# Altium project stm32dev.PrjPcb
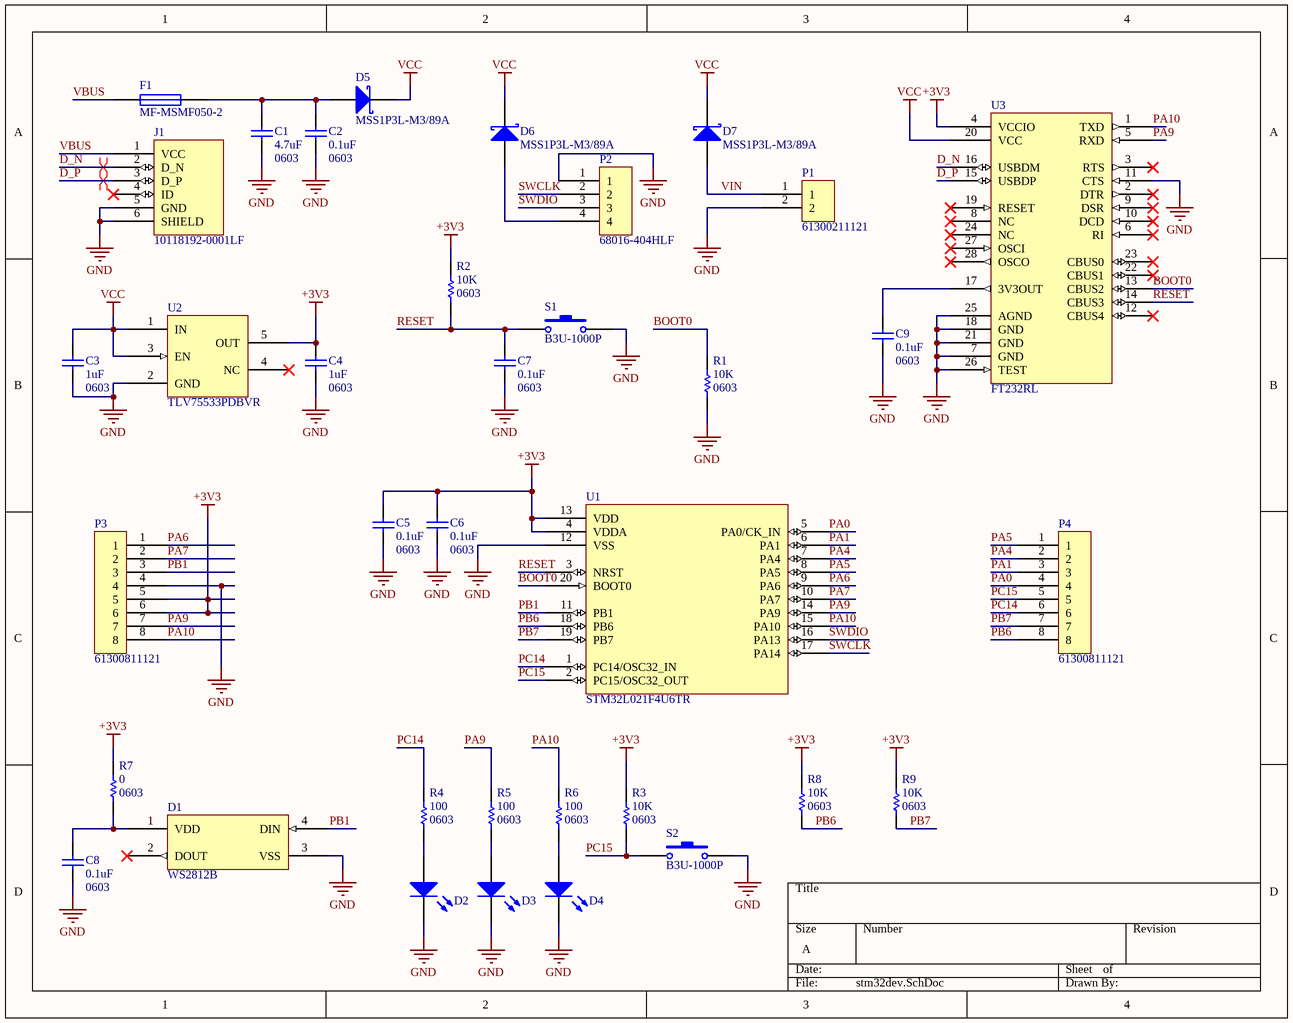
[diagram p0: stm32dev.SchDoc]
1 sheet, 36 parts. Net scope: global (net labels, ports and power ports of the same name join across sheets).
Board file: stm32dev.PcbDoc

## Sheet stm32dev.SchDoc: STM32DEV
size A; Revision: 1; SheetNumber: 1; SheetTotal: 1

### Parts
C1  value 4.7uF  Package: 0603  [CAPC1608X09N]  (hidden comment: Capacitor)
C2  value 0.1uF  Package: 0603  [CAPC1608X09N]  (hidden comment: Capacitor)
C3  value 1uF  Package: 0603  [CAPC1608X09N]  (hidden comment: Capacitor)
C4  value 1uF  Package: 0603  [CAPC1608X09N]  (hidden comment: Capacitor)
C5  value 0.1uF  Package: 0603  [CAPC1608X09N]  (hidden comment: Capacitor)
C6  value 0.1uF  Package: 0603  [CAPC1608X09N]  (hidden comment: Capacitor)
C7  value 0.1uF  Package: 0603  [CAPC1608X09N]  (hidden comment: Capacitor)
C8  value 0.1uF  Package: 0603  [CAPC1608X09N]  (hidden comment: Capacitor)
C9  value 0.1uF  Package: 0603  [CAPC1608X09N]  (hidden comment: Capacitor)
D1  WS2812B  [5050]
D2  LED  [DIOC1608X09N]  (value not drawn)
D3  LED  [DIOC1608X09N]  (value not drawn)
D4  LED  [DIOC1608X09N]  (value not drawn)
D5  MSS1P3L-M3/89A  [DO-219AD]
D6  MSS1P3L-M3/89A  [DO-219AD]
D7  MSS1P3L-M3/89A  [DO-219AD]
F1  MF-MSMF050-2  [1812 (4532 Metric)]
J1  10118192-0001LF  [10118192-0001LF]
P1  61300211121  [2X1 MALE HEADER]
P2  68016-404HLF  [68016-404HLF]
P3  61300811121  [8X1 MALE HEADER]
P4  61300811121  [8X1 MALE HEADER]
R1  value 10K  Package: 0603  [RESC1608X06N]  (hidden comment: Resistor)
R2  value 10K  Package: 0603  [RESC1608X06N]  (hidden comment: Resistor)
R3  value 10K  Package: 0603  [RESC1608X06N]  (hidden comment: Resistor)
R4  value 100  Package: 0603  [RESC1608X06N]  (hidden comment: Resistor)
R5  value 100  Package: 0603  [RESC1608X06N]  (hidden comment: Resistor)
R6  value 100  Package: 0603  [RESC1608X06N]  (hidden comment: Resistor)
R7  value 0  Package: 0603  [RESC1608X06N]  (hidden comment: Resistor)
R8  value 10K  Package: 0603  [RESC1608X06N]  (hidden comment: Resistor)
R9  value 10K  Package: 0603  [RESC1608X06N]  (hidden comment: Resistor)
S1  B3U-1000P  [B3U-1000P]
S2  B3U-1000P  [B3U-1000P]
U1  STM32L021F4U6TR  [QFN50P300X300X60-20N]
U2  TLV75533PDBVR  [SOT95P280X145-5N]
U3  FT232RL  [SOP65P780X200-28N]

### Nets
+3V3: C4.2 C5.2 C6.2 P3.5 P3.6 R2.2 R3.2 R7.2 R8.2 R9.2 U1.4(VDDA) U1.13(VDD) U2.5(OUT) U3.4(VCCIO)
GND: C1.1 C2.1 C3.1 C4.1 C5.1 C6.1 C7.1 C8.1 C9.1 D1.3(VSS) D2.2(K) D3.2(K) D4.2(K) J1.5(GND) J1.6(SHIELD) P1.2 P2.1 P3.4 R1.1 S1.2 S2.2 U1.12(VSS) U2.2(GND) U3.7(GND) U3.11(CTS) U3.18(GND) U3.21(GND) U3.25(AGND) U3.26(TEST)
VCC: C3.2 D5.2(K) D6.2(K) D7.2(K) U2.1(IN) U2.3(EN) U3.20(VCC)
BOOT0: R1.2 U1.20(BOOT0) U3.13(CBUS2)
D_N: J1.2(D_N) U3.16(USBDM)
D_P: J1.3(D_P) U3.15(USBDP)
PA0: P4.4 U1.5(PA0/CK_IN)
PA1: P4.3 U1.6(PA1)
PA4: P4.2 U1.7(PA4)
PA5: P4.1 U1.8(PA5)
PA6: P3.1 U1.9(PA6)
PA7: P3.2 U1.10(PA7)
PA9: P3.7 R5.2 U1.14(PA9) U3.5(RXD)
PA10: P3.8 R6.2 U1.15(PA10) U3.1(TXD)
PB1: D1.4(DIN) P3.3 U1.11(PB1)
PB6: P4.8 R8.1 U1.18(PB6)
PB7: P4.7 R9.1 U1.19(PB7)
PC14: P4.6 R4.2 U1.1(PC14/OSC32_IN)
PC15: P4.5 R3.1 S2.1 U1.2(PC15/OSC32_OUT)
RESET: C7.2 R2.1 S1.1 U1.3(NRST) U3.14(CBUS3)
SWCLK: P2.2 U1.17(PA14)
SWDIO: P2.3 U1.16(PA13)
VBUS: F1.1 J1.1(VCC)
VIN: D7.1(A) P1.1
NetC1_2: C1.2 C2.2 D5.1(A) F1.2
NetC8_2: C8.2 D1.1(VDD) R7.1
NetC9_2: C9.2 U3.17(3V3OUT)
NetD2_1: D2.1(A) R4.1
NetD3_1: D3.1(A) R5.1
NetD4_1: D4.1(A) R6.1
NetD6_1: D6.1(A) P2.4

Not connected (* = marked no-connect by the designer): D1 2(DOUT)*; J1 4(ID)*; U2 4(NC)*; U3 2(DTR)* 3(RTS)* 6(RI)* 8(NC)* 9(DSR)* 10(DCD)* 12(CBUS4)* 19(RESET)* 22(CBUS1)* 23(CBUS0)* 24(NC)* 27(OSCI)* 28(OSCO)*

### Layout directives
differential pair: D_N, D_P

### Library data of the parts
C1-C9 = Capacitor: General purpose capacitor
D1 = WS2812B: NeoPixel 5050 RGB LED with Integrated Driver Chip; Manufacturer: Adafruit Industries; Manufacturer Part Number: 1655; Color: Blue; Number of LEDs: 10; Supplier 1: Digi-Key; Stock 1: 4542; Pricing 1: 1 = 4.50000 (USD); Mount: Surface Mount; Length: 5mm; Width: 5mm; ComponentLink1URL: http://www.mouser.com/ds/2/737/SK6812_LED_datasheet_-953546.pdf?src-supplier=Mouser; ComponentLink1Description: http://www.mouser.com/ds/2/737/SK6812_LED_datasheet_-953546.pdf?src-supplier=Mouser; ComponentLink2URL: https://cdn-shop.adafruit.com/product-files/1138/SK6812+LED+datasheet+.pdf?src-supplier=Digi-Key; ComponentLink2Description: https://cdn-shop.adafruit.com/product-files/1138/SK6812+LED+datasheet+.pdf?src-supplier=Digi-Key; ComponentLink3URL: http://datasheet.octopart.com/ADA1655-Adafruit-Industries-datasheet-32028139.pdf; ComponentLink3Description: http://datasheet.octopart.com/ADA1655-Adafruit-Industries-datasheet-32028139.pdf
D2-D4 = LED: General purpose LED
D5-D7 = MSS1P3L-M3/89A: DIODE SCHOTTKY 30V 1A MICROSMP; Manufacturer: Vishay Semiconductors; Forward Voltage: 500mV; Element Configuration: Single; Peak Non-Repetitive Surge Current: 25A; Peak Reverse Current: 250uA; Supplier 1: Digi-Key; Manufacturer Part Number: MSS1P3L-M3/89A; Stock 1: 323215; Pricing 1: 1=0.41000, 10=0.30700, 100=0.14600, 500=0.11910, 1000=0.08837 (USD); RoHS: Yes; Mount: Surface Mount; Number of Pins: 2; Min Operating Temperature: -55°C; Max Operating Temperature: 150°C; Packaging: Tape and Reel; Forward Current: 1A; Average Rectified Current: 1A; Max Repetitive Reverse Voltage (Vrrm): 30V; Max Reverse Voltage (DC): 30V; Max Surge Current: 25A; Package Quantity: 1; Max Reverse Leakage Current: 250uA; Max Forward Surge Current (Ifsm): 25A; Length: 0.09inch; Height: 0.018inch; Width: 0.055inch; Radiation Hardening: No; REACH SVHC: Unknown; Lead Free: Lead Free; ComponentLink1URL: https://datasheet.ciiva.com/23642/mss1p3l-23642464.pdf?src-supplier=Newark; ComponentLink1Description: https://datasheet.ciiva.com/23642/mss1p3l-23642464.pdf?src-supplier=Newark; ComponentLink2URL: https://datasheet.ciiva.com/917/mss1p3l-917251.pdf?src-supplier=Digi-Key; ComponentLink2Description: https://datasheet.ciiva.com/917/mss1p3l-917251.pdf?src-supplier=Digi-Key; ComponentLink3URL: https://datasheet.ciiva.com/917/mss1p3l-917252.pdf?src-supplier=Digi-Key; ComponentLink3Description: https://datasheet.ciiva.com/917/mss1p3l-917252.pdf?src-supplier=Digi-Key; ComponentLink4URL: https://datasheet.ciiva.com/917/mss1p3l-917253.pdf?src-supplier=Digi-Key; ComponentLink4Description: https://datasheet.ciiva.com/917/mss1p3l-917253.pdf?src-supplier=Digi-Key; ComponentLink5URL: https://datasheet.ciiva.com/25934/mss1p3l-25934805.pdf?src-supplier=Avnet+Europe; ComponentLink5Description: https://datasheet.ciiva.com/25934/mss1p3l-25934805.pdf?src-supplier=Avnet+Europe; ComponentLink6URL: https://datasheet.ciiva.com/16464/mss1p3l-16464118.pdf?src-supplier=Future+Electronics; ComponentLink6Description: https://datasheet.ciiva.com/16464/mss1p3l-16464118.pdf?src-supplier=Future+Electronics; ComponentLink7URL: https://datasheet.ciiva.com/8290/mss1p3l-8290391.pdf?src-supplier=Avnet; ComponentLink7Description: https://datasheet.ciiva.com/8290/mss1p3l-8290391.pdf?src-supplier=Avnet; ComponentLink8URL: https://datasheet.ciiva.com/7962/mss1p3l-7962344.pdf?src-supplier=Element14; ComponentLink8Description: https://datasheet.ciiva.com/7962/mss1p3l-7962344.pdf?src-supplier=Element14
F1 = MF-MSMF050-2: PTC Resettable Fuse 100A 15V T/R; Manufacturer: Bourns; Power Dissipation: 800mW; Hold Current: 500mA; Trip Current: 1A; Resistance: 150mR; Time to Trip: 0.15s; Approvals: UL,CSA,TUV; Supplier 1: Digi-Key; Manufacturer Part Number: MF-MSMF050-2; Stock 1: 93624; Pricing 1: 1=0.47000, 5=0.45800, 10=0.44400, 50=0.37340, 100=0.31010, 250=0.28188, 500=0.23960, 1000=0.21141 (USD); RoHS: Yes; Mount: Surface Mount,PCB; Case/Package: 1812; Case Code (Metric): 4532; Case Code (Imperial): 1812; Number of Terminals: 2; Contact Plating: Gold; Terminal Material: Gold; Min Operating Temperature: -40°C; Max Operating Temperature: 85°C; Package Quantity: 2000; Packaging: Tape and Reel; Max Current Rating: 100A; Voltage Rating: 15V; Operating Supply Voltage: 15V; Current Rating: 100A; Termination: SMD/SMT; Voltage Rating (DC): 15V; Length: 4.73mm; Height: 0.85mm; Width: 3.41mm; Radiation Hardening: No; REACH SVHC: No SVHC; Lead Free: Lead Free; ComponentLink1URL: https://datasheet.ciiva.com/34302/1164200-34302041.pdf?src-supplier=Jameco; ComponentLink1Description: https://datasheet.ciiva.com/34302/1164200-34302041.pdf?src-supplier=Jameco; ComponentLink2URL: https://datasheet.ciiva.com/326/mfmsmf-326354.pdf?src-supplier=Digi-Key; ComponentLink2Description: https://datasheet.ciiva.com/326/mfmsmf-326354.pdf?src-supplier=Digi-Key; ComponentLink3URL: https://datasheet.ciiva.com/1228/1786007-1228155.pdf?src-supplier=Newark; ComponentLink3Description: https://datasheet.ciiva.com/1228/1786007-1228155.pdf?src-supplier=Newark; ComponentLink4URL: https://datasheet.ciiva.com/16205/mfmsmf-16205994.pdf?src-supplier=Onlinecomponents.com; ComponentLink4Description: https://datasheet.ciiva.com/16205/mfmsmf-16205994.pdf?src-supplier=Onlinecomponents.com; ComponentLink5URL: https://datasheet.ciiva.com/14537/70153434-14537737.pdf?src-supplier=Allied+Electronics; ComponentLink5Description: https://datasheet.ciiva.com/14537/70153434-14537737.pdf?src-supplier=Allied+Electronics; ComponentLink6URL: https://datasheet.ciiva.com/46395/1695373-46395287.pdf?src-supplier=Element14; ComponentLink6Description: https://datasheet.ciiva.com/46395/1695373-46395287.pdf?src-supplier=Element14; ComponentLink7URL: https://datasheet.ciiva.com/22749/1695373-22749079.pdf?src-supplier=Element14; ComponentLink7Description: https://datasheet.ciiva.com/22749/1695373-22749079.pdf?src-supplier=Element14; ComponentLink8URL: https://datasheet.ciiva.com/32426/mf-msmf-series-eng-tds-32426126.pdf?src-supplier=Distrelec; ComponentLink8Description: https://datasheet.ciiva.com/32426/mf-msmf-series-eng-tds-32426126.pdf?src-supplier=Distrelec; ComponentLink9URL: https://datasheet.ciiva.com/4501/mfmsmf-72300-4501655.pdf?src-supplier=Mouser; ComponentLink9Description: https://datasheet.ciiva.com/4501/mfmsmf-72300-4501655.pdf?src-supplier=Mouser; ComponentLink10URL: https://datasheet.ciiva.com/3019/mfmsmf-3019622.pdf?src-supplier=Avnet; ComponentLink10Description: https://datasheet.ciiva.com/3019/mfmsmf-3019622.pdf?src-supplier=Avnet; ComponentLink11URL: https://datasheet.ciiva.com/3019/mfmsmf-3019621.pdf?src-supplier=Avnet; ComponentLink11Description: https://datasheet.ciiva.com/3019/mfmsmf-3019621.pdf?src-supplier=Avnet; ComponentLink12URL: https://datasheet.ciiva.com/326/mfmsmf-326356.pdf?src-supplier=Digi-Key; ComponentLink12Description: https://datasheet.ciiva.com/326/mfmsmf-326356.pdf?src-supplier=Digi-Key; ComponentLink13URL: https://datasheet.ciiva.com/1274/1786007-1274499.pdf?src-supplier=Element14; ComponentLink13Description: https://datasheet.ciiva.com/1274/1786007-1274499.pdf?src-supplier=Element14; ComponentLink14URL: https://datasheet.ciiva.com/326/mfmsmf-326355.pdf?src-supplier=Digi-Key; ComponentLink14Description: https://datasheet.ciiva.com/326/mfmsmf-326355.pdf?src-supplier=Digi-Key; ComponentLink15URL: https://datasheet.ciiva.com/1274/1786007-1274498.pdf?src-supplier=Element14; ComponentLink15Description: https://datasheet.ciiva.com/1274/1786007-1274498.pdf?src-supplier=Element14; ComponentLink16URL: https://datasheet.ciiva.com/15226/getdatasheetpartid-117168-15226886.pdf?src-supplier=Verical; ComponentLink16Description: https://datasheet.ciiva.com/15226/getdatasheetpartid-117168-15226886.pdf?src-supplier=Verical; ComponentLink17URL: https://datasheet.ciiva.com/25894/mfmsmf-25894175.pdf?src-supplier=Avnet+Europe; ComponentLink17Description: https://datasheet.ciiva.com/25894/mfmsmf-25894175.pdf?src-supplier=Avnet+Europe
J1 = 10118192-0001LF: Conn Micro USB 2.0 Type B RCP 5 POS 0.65mm Solder RA SMD 5 Terminal 1 Port T/R; Manufacturer: Framatome Connectors; Gender: Receptacle; Current Rating: 1.8A; Number of Contacts: 5; Insulation Resistance: 1GR; Number of Ports: 1; Max Voltage Rating (AC): 100V; USB Standard: USB 2.0; Supplier 1: Digi-Key; Manufacturer Part Number: 10118192-0001LF; Stock 1: 43734; Pricing 1: 1 = 0.43000, 10 = 0.40500, 25 = 0.36440, 50 = 0.32400, 100 = 0.31040, 250 = 0.28344, 500 = 0.26994 (USD); Mount: Surface Mount; Contact Material: Copper Alloy; Contact Plating: Gold; Color: Black; Number of Terminals: 5; Housing Material: Polymer; Min Operating Temperature: -55°C; Max Operating Temperature: 85°C; Packaging: Tape and Reel; Package Quantity: 1400; Connector Type: USB; Termination: Solder; Voltage Rating: 100V; Orientation: Right Angle; Features: Shielded; Length: 7.86mm; Pitch: 0.65mm; Depth: 5.57mm; Radiation Hardening: No; REACH SVHC: No SVHC; Lead Free: Lead Free; Flammability Rating: UL94 V-0; ComponentLink1URL: https://datasheet.ciiva.com/26853/getdatasheetpartid-418041-26853891.pdf?src-supplier=Verical; ComponentLink1Description: https://datasheet.ciiva.com/26853/getdatasheetpartid-418041-26853891.pdf?src-supplier=Verical; ComponentLink2URL: https://datasheet.ciiva.com/851/10118192-851112.pdf?src-supplier=Digi-Key; ComponentLink2Description: https://datasheet.ciiva.com/851/10118192-851112.pdf?src-supplier=Digi-Key; ComponentLink3URL: https://datasheet.ciiva.com/4598/10118192ac-197249-4598796.pdf?src-supplier=Mouser; ComponentLink3Description: https://datasheet.ciiva.com/4598/10118192ac-197249-4598796.pdf?src-supplier=Mouser; ComponentLink4URL: http://datasheet.octopart.com/10118192-0001LF-FCI-datasheet-55953129.pdf?src-supplier=TME; ComponentLink4Description: http://datasheet.octopart.com/10118192-0001LF-FCI-datasheet-55953129.pdf?src-supplier=TME; ComponentLink5URL: http://datasheet.octopart.com/10118192-0001LF-FCI-datasheet-13423637.pdf?src-supplier=Allied+Electronics; ComponentLink5Description: http://datasheet.octopart.com/10118192-0001LF-FCI-datasheet-13423637.pdf?src-supplier=Allied+Electronics; ComponentLink6URL: http://datasheet.octopart.com/10118192-0001LF-Amphenol-datasheet-96019471.pdf?src-supplier=Newark; ComponentLink6Description: http://datasheet.octopart.com/10118192-0001LF-Amphenol-datasheet-96019471.pdf?src-supplier=Newark; ComponentLink7URL: http://datasheet.octopart.com/10118192-0001LF-Amphenol-ICC-datasheet-96019471.pdf?src-supplier=Element14; ComponentLink7Description: http://datasheet.octopart.com/10118192-0001LF-Amphenol-ICC-datasheet-96019471.pdf?src-supplier=Element14; ComponentLink8URL: http://datasheet.octopart.com/10118192-0001LF-Amphenol-ICC-datasheet-55953129.pdf?src-supplier=Future+Electronics; ComponentLink8Description: http://datasheet.octopart.com/10118192-0001LF-Amphenol-ICC-datasheet-55953129.pdf?src-supplier=Future+Electronics; ComponentLink9URL: http://datasheet.octopart.com/10118192-0001LF-Amphenol-ICC-datasheet-13423637.pdf?src-supplier=Allied+Electronics; ComponentLink9Description: http://datasheet.octopart.com/10118192-0001LF-Amphenol-ICC-datasheet-13423637.pdf?src-supplier=Allied+Electronics; ComponentLink10URL: http://datasheet.octopart.com/10118192-0001LF-ICC-datasheet-96019471.pdf?src-supplier=Farnell; ComponentLink10Description: http://datasheet.octopart.com/10118192-0001LF-ICC-datasheet-96019471.pdf?src-supplier=Farnell; ComponentLink11URL: http://datasheet.octopart.com/10118192-0001LF-ICC-datasheet-55953129.pdf?src-supplier=Farnell; ComponentLink11Description: http://datasheet.octopart.com/10118192-0001LF-ICC-datasheet-55953129.pdf?src-supplier=Farnell
P1 = 61300211121: Headers & Wire Housings WR-PHD 2.54mm 2Pin THT Header; Manufacturer: Wurth Electronics; Current Rating: 3A; Voltage Rating: 250V; Number of Positions: 2; Gender: Male; Connector Type: Male Pin; Pitch: 0.1inch; Supplier 1: Digi-Key; Manufacturer Part Number: 61300211121; Stock 1: 208781; Pricing 1: 1=0.13000, 10=0.10600, 25=0.08800, 50=0.07400, 100=0.06700, 1000=0.06100 (USD); RoHS: Yes; Mount: Through Hole; Contact Plating: Gold; Housing Material: PBT; Contact Material: Copper Alloy,Copper; Color: Black; Min Operating Temperature: -40°C; Max Operating Temperature: 125°C; Number of Rows: 1; Contact Gender: Male; Packaging: Bulk; Termination: Through Hole; Number of Contacts: 2; Contact Mating Length: 0.236inch; REACH SVHC: Unknown; Lead Free: Lead Free; ComponentLink1URL: https://datasheet.ciiva.com/13619/6130xx11121-48870-13619345.pdf?src-supplier=Mouser; ComponentLink1Description: https://datasheet.ciiva.com/13619/6130xx11121-48870-13619345.pdf?src-supplier=Mouser
P2 = 68016-404HLF: CONN HEADER 4POS .100 R/A TIN; Manufacturer: Amphenol FCI; Current Rating: 3A; Voltage Rating: 1.5kV; Number of Positions: 4; Insulation Resistance: 5GR; Gender: Male; Connector Type: Male Pin; Pitch: 2.54mm; Contact Post Length: 3.05mm; Supplier 1: Digi-Key; Manufacturer Part Number: 68016-404HLF; Stock 1: 4219; Pricing 1: 1=0.18000, 10=0.17000, 100=0.11800, 500=0.09988, 1000=0.08172, 5000=0.07264, 10000=0.06583 (USD); RoHS: Yes; Mount: Through Hole; Contact Plating: Tin; Contact Material: Bronze; Color: Black; Housing Color: Black; Housing Material: Thermoplastic; Min Operating Temperature: -65°C; Max Operating Temperature: 125°C; Number of Rows: 1; Contact Gender: Male; Packaging: Bulk; Package Quantity: 100; Termination: Solder; Number of Contacts: 4; Max Voltage Rating (AC): 1.5kV; Orientation: Right Angle; Length: 10.16mm; Contact Mating Length: 0.23inch; Depth: 9.9mm; Radiation Hardening: No; Flammability Rating: UL94 V-0; Lead Free: Lead Free; ComponentLink1URL: https://datasheet.ciiva.com/10144/68015-10144694.pdf?src-supplier=Avnet; ComponentLink1Description: https://datasheet.ciiva.com/10144/68015-10144694.pdf?src-supplier=Avnet; ComponentLink2URL: https://datasheet.ciiva.com/721/68015-721854.pdf?src-supplier=Digi-Key; ComponentLink2Description: https://datasheet.ciiva.com/721/68015-721854.pdf?src-supplier=Digi-Key
P3 P4 = 61300811121: WURTH ELEKTRONIK         61300811121            Board-To-Board Connector, Vertical, WR-PHD Series, Through Hole, Header, 8 Contacts, 2.54 mm; Manufacturer: Wurth Electronics; Number of Positions: 8; Gender: Male; Connector Type: Male Pin; Pitch: 0.1inch; Supplier 1: Digi-Key; Manufacturer Part Number: 61300811121; Stock 1: 5439; Pricing 1: 1=0.37000, 10=0.31500, 25=0.26320, 50=0.21900, 100=0.19900, 1000=0.18100 (USD); RoHS: Yes; Mount: Through Hole; Contact Plating: Gold; Contact Material: Copper; Color: Black; Number of Rows: 1; Packaging: Bulk; Termination: Solder; Number of Contacts: 8; Contact Mating Length: 0.236inch; REACH SVHC: Unknown; ComponentLink1URL: http://www.farnell.com/cad/1737268.pdf?src-supplier=Element14; ComponentLink1Description: http://www.farnell.com/cad/1737268.pdf?src-supplier=Element14; ComponentLink2URL: https://katalog.we-online.de/em/datasheet/6130xx11121.pdf?src-supplier=Digi-Key; ComponentLink2Description: https://katalog.we-online.de/em/datasheet/6130xx11121.pdf?src-supplier=Digi-Key
R1-R9 = Resistor: General purpose resistor
S1 S2 = B3U-1000P: OMRON ELECTRONIC COMPONENTS         B3U-1000P            SWITCH, SPST-NO, 0.05A, 12V, SMD; Mechanical Life: 200000Cycles; Operating Force: 1.5N; Throw Configuration: SPST; Current Rating: 50mA; Contact Resistance: 100mR; Illumination Type: Non-Illuminated,Illuminated; Switch Travel: 0.15mm; Switch Function: Off-Mom; Actuator Type: Standard; Actuator Length: 0.4mm; Ratings: Dust Proof,IP40; Supplier 1: Digi-Key; Manufacturer: Omron; Manufacturer Part Number: B3U-1000P; Stock 1: 38234; Pricing 1: 1=0.84000, 10=0.80700, 25=0.76080, 50=0.66960, 100=0.60880, 250=0.57836, 500=0.56312, 1000=0.44137 (USD); RoHS: Yes; Mount: Surface Mount; Weight: 0.000776oz; Contact Material: Silver; Min Operating Temperature: -25°C; Max Operating Temperature: 70°C; Packaging: Tape and Reel; Voltage Rating (DC): 12V; Package Quantity: 1; Max Current Rating: 50mA; Termination: SMD/SMT; Orientation: Straight; Max Voltage Rating (DC): 12V; Electrical Life: 200000Cycles; Insulation Resistance: 100MR; Contact Current Rating: 50mA; Length: 4mm; Height: 1.2mm; Depth: 2.5mm; Width: 3mm; REACH SVHC: Unknown; Lead Free: Lead Free; ComponentLink1URL: https://datasheet.ciiva.com/26917/getdatasheetpartid-552554-26917552.pdf?src-supplier=Verical; ComponentLink1Description: https://datasheet.ciiva.com/26917/getdatasheetpartid-552554-26917552.pdf?src-supplier=Verical; ComponentLink2URL: https://datasheet.ciiva.com/22696/1685550-22696214.pdf?src-supplier=Element14; ComponentLink2Description: https://datasheet.ciiva.com/22696/1685550-22696214.pdf?src-supplier=Element14; ComponentLink3URL: https://datasheet.ciiva.com/1532/1685550-1532680.pdf?src-supplier=Element14; ComponentLink3Description: https://datasheet.ciiva.com/1532/1685550-1532680.pdf?src-supplier=Element14; ComponentLink4URL: https://datasheet.ciiva.com/1634/1685550-1634396.pdf?src-supplier=Farnell; ComponentLink4Description: https://datasheet.ciiva.com/1634/1685550-1634396.pdf?src-supplier=Farnell; ComponentLink5URL: https://datasheet.ciiva.com/14142/b3u-eng-datasheet-14142540.pdf?src-supplier=Distrelec; ComponentLink5Description: https://datasheet.ciiva.com/14142/b3u-eng-datasheet-14142540.pdf?src-supplier=Distrelec; ComponentLink6URL: https://datasheet.ciiva.com/2900/b3u-1110-2900029.pdf?src-supplier=Digi-Key; ComponentLink6Description: https://datasheet.ciiva.com/2900/b3u-1110-2900029.pdf?src-supplier=Digi-Key; ComponentLink7URL: https://datasheet.ciiva.com/16155/en-b3u-16155021.pdf?src-supplier=Onlinecomponents.com; ComponentLink7Description: https://datasheet.ciiva.com/16155/en-b3u-16155021.pdf?src-supplier=Onlinecomponents.com; ComponentLink8URL: https://datasheet.ciiva.com/2900/b3u-1110-2900030.pdf?src-supplier=Digi-Key; ComponentLink8Description: https://datasheet.ciiva.com/2900/b3u-1110-2900030.pdf?src-supplier=Digi-Key; ComponentLink9URL: https://datasheet.ciiva.com/16862/70176037-16862846.pdf?src-supplier=Allied+Electronics; ComponentLink9Description: https://datasheet.ciiva.com/16862/70176037-16862846.pdf?src-supplier=Allied+Electronics; ComponentLink10URL: https://datasheet.ciiva.com/2900/b3u-1110-2900031.pdf?src-supplier=Digi-Key; ComponentLink10Description: https://datasheet.ciiva.com/2900/b3u-1110-2900031.pdf?src-supplier=Digi-Key
U1 = STM32L021F4U6TR: MCU 32-Bit STM32L021x4 ARM Cortex M0+ RISC 16KB Flash 2.5V/3.3V 20-Pin UFQFPN T/R; Manufacturer: STMicroelectronics; Supplier 1: Mouser; Manufacturer Part Number: STM32L021F4U6TR; Stock 1: 77; Pricing 1: 1 = 1.94000, 10 = 1.65000, 100 = 1.32000, 500 = 1.16000, 1000 = 0.95600, 3000 = 0.89000 (USD); ComponentLink1URL: http://www.st.com/content/ccc/resource/technical/document/datasheet/86/a6/5f/95/33/50/4e/d6/DM00206858.pdf/files/DM00206858.pdf/jcr:content/translations/en.DM00206858.pdf?src-supplier=Digi-Key; ComponentLink1Description: http://www.st.com/content/ccc/resource/technical/document/datasheet/86/a6/5f/95/33/50/4e/d6/DM00206858.pdf/files/DM00206858.pdf/jcr:content/translations/en.DM00206858.pdf?src-supplier=Digi-Key; ComponentLink2URL: http://datasheet.octopart.com/STM32L021F4U6TR-STMicroelectronics-datasheet-62073766.pdf?src-supplier=STMicroelectronics; ComponentLink2Description: http://datasheet.octopart.com/STM32L021F4U6TR-STMicroelectronics-datasheet-62073766.pdf?src-supplier=STMicroelectronics; ComponentLink3URL: http://datasheet.octopart.com/STM32L021F4U6TR-STMicroelectronics-datasheet-62336774.pdf?src-supplier=STMicroelectronics; ComponentLink3Description: http://datasheet.octopart.com/STM32L021F4U6TR-STMicroelectronics-datasheet-62336774.pdf?src-supplier=STMicroelectronics
U2 = TLV75533PDBVR: IC REG LINEAR 3.3V 500MA SOT23-5; Manufacturer: Texas Instruments; Supplier 1: Digi-Key; Manufacturer Part Number: TLV75533PDBVR; Stock 1: 25120; Pricing 1: 1=0.63000, 10=0.55100, 100=0.39250, 500=0.31730, 1000=0.24215 (USD); RoHS: No; Min Operating Temperature: -40°C; Max Operating Temperature: 125°C; ComponentLink1URL: http://www.ti.com/lit/ds/symlink/tlv755p.pdf?src-supplier=Digi-Key; ComponentLink1Description: http://www.ti.com/lit/ds/symlink/tlv755p.pdf?src-supplier=Digi-Key
U3 = FT232RL: IC USB FS SERIAL UART 28-SSOP; Manufacturer: FTDI; Manufacturer Part Number: FT232RL-REEL; Interface: UART,RS-232,RS-422,RS-485; Number of Channels: 1; Data Rate: 12Mbps; Max Supply Voltage: 5.25V; Min Supply Voltage: 3.3V; Operating Supply Current: 15mA; Voltage: 5V; Supplier 1: Digi-Key; Stock 1: 32837; Pricing 1: 1=4.50000, 10=4.05000, 50=3.85000, 100=3.65000, 250=3.25000, 500=2.85002, 1000=2.65000 (USD); RoHS: Yes; Mount: Surface Mount; Case/Package: SSOP; Number of Pins: 28; Weight: 0.080001oz; Min Operating Temperature: -40°C; Max Operating Temperature: 85°C; Package Quantity: 2000; Packaging: Tape and Reel; Number of Transceivers: 1; Length: 10.2mm; Height: 1.75mm; Width: 5.3mm; Radiation Hardening: No; REACH SVHC: No SVHC; Lead Free: Lead Free; ComponentLink1URL: https://datasheet.ciiva.com/34304/2161019-34304054.pdf?src-supplier=Jameco; ComponentLink1Description: https://datasheet.ciiva.com/34304/2161019-34304054.pdf?src-supplier=Jameco; ComponentLink2URL: https://datasheet.ciiva.com/4787/ds-ft232r-11534-4787658.pdf?src-supplier=Mouser; ComponentLink2Description: https://datasheet.ciiva.com/4787/ds-ft232r-11534-4787658.pdf?src-supplier=Mouser; ComponentLink3URL: https://datasheet.ciiva.com/26841/ft232rl-reel-26841080.pdf?src-supplier=IIIC; ComponentLink3Description: https://datasheet.ciiva.com/26841/ft232rl-reel-26841080.pdf?src-supplier=IIIC; ComponentLink4URL: https://datasheet.ciiva.com/1787/ds-ft232r-1787047.pdf?src-supplier=Digi-Key; ComponentLink4Description: https://datasheet.ciiva.com/1787/ds-ft232r-1787047.pdf?src-supplier=Digi-Key; ComponentLink5URL: https://datasheet.ciiva.com/1787/ds-ft232r-1787048.pdf?src-supplier=Digi-Key; ComponentLink5Description: https://datasheet.ciiva.com/1787/ds-ft232r-1787048.pdf?src-supplier=Digi-Key; ComponentLink6URL: https://datasheet.ciiva.com/1787/ds-ft232r-1787049.pdf?src-supplier=Digi-Key; ComponentLink6Description: https://datasheet.ciiva.com/1787/ds-ft232r-1787049.pdf?src-supplier=Digi-Key; ComponentLink7URL: https://datasheet.ciiva.com/15150/getdatasheetpartid-643207-15150506.pdf?src-supplier=Verical; ComponentLink7Description: https://datasheet.ciiva.com/15150/getdatasheetpartid-643207-15150506.pdf?src-supplier=Verical; ComponentLink8URL: https://datasheet.ciiva.com/16200/ds-ft232r-16200652.pdf?src-supplier=Future+Electronics; ComponentLink8Description: https://datasheet.ciiva.com/16200/ds-ft232r-16200652.pdf?src-supplier=Future+Electronics